# Altium schematic sheet connectors1.0.SchDoc
size 431 x 279 mm; SheetNumber: 1; SheetTotal: 1
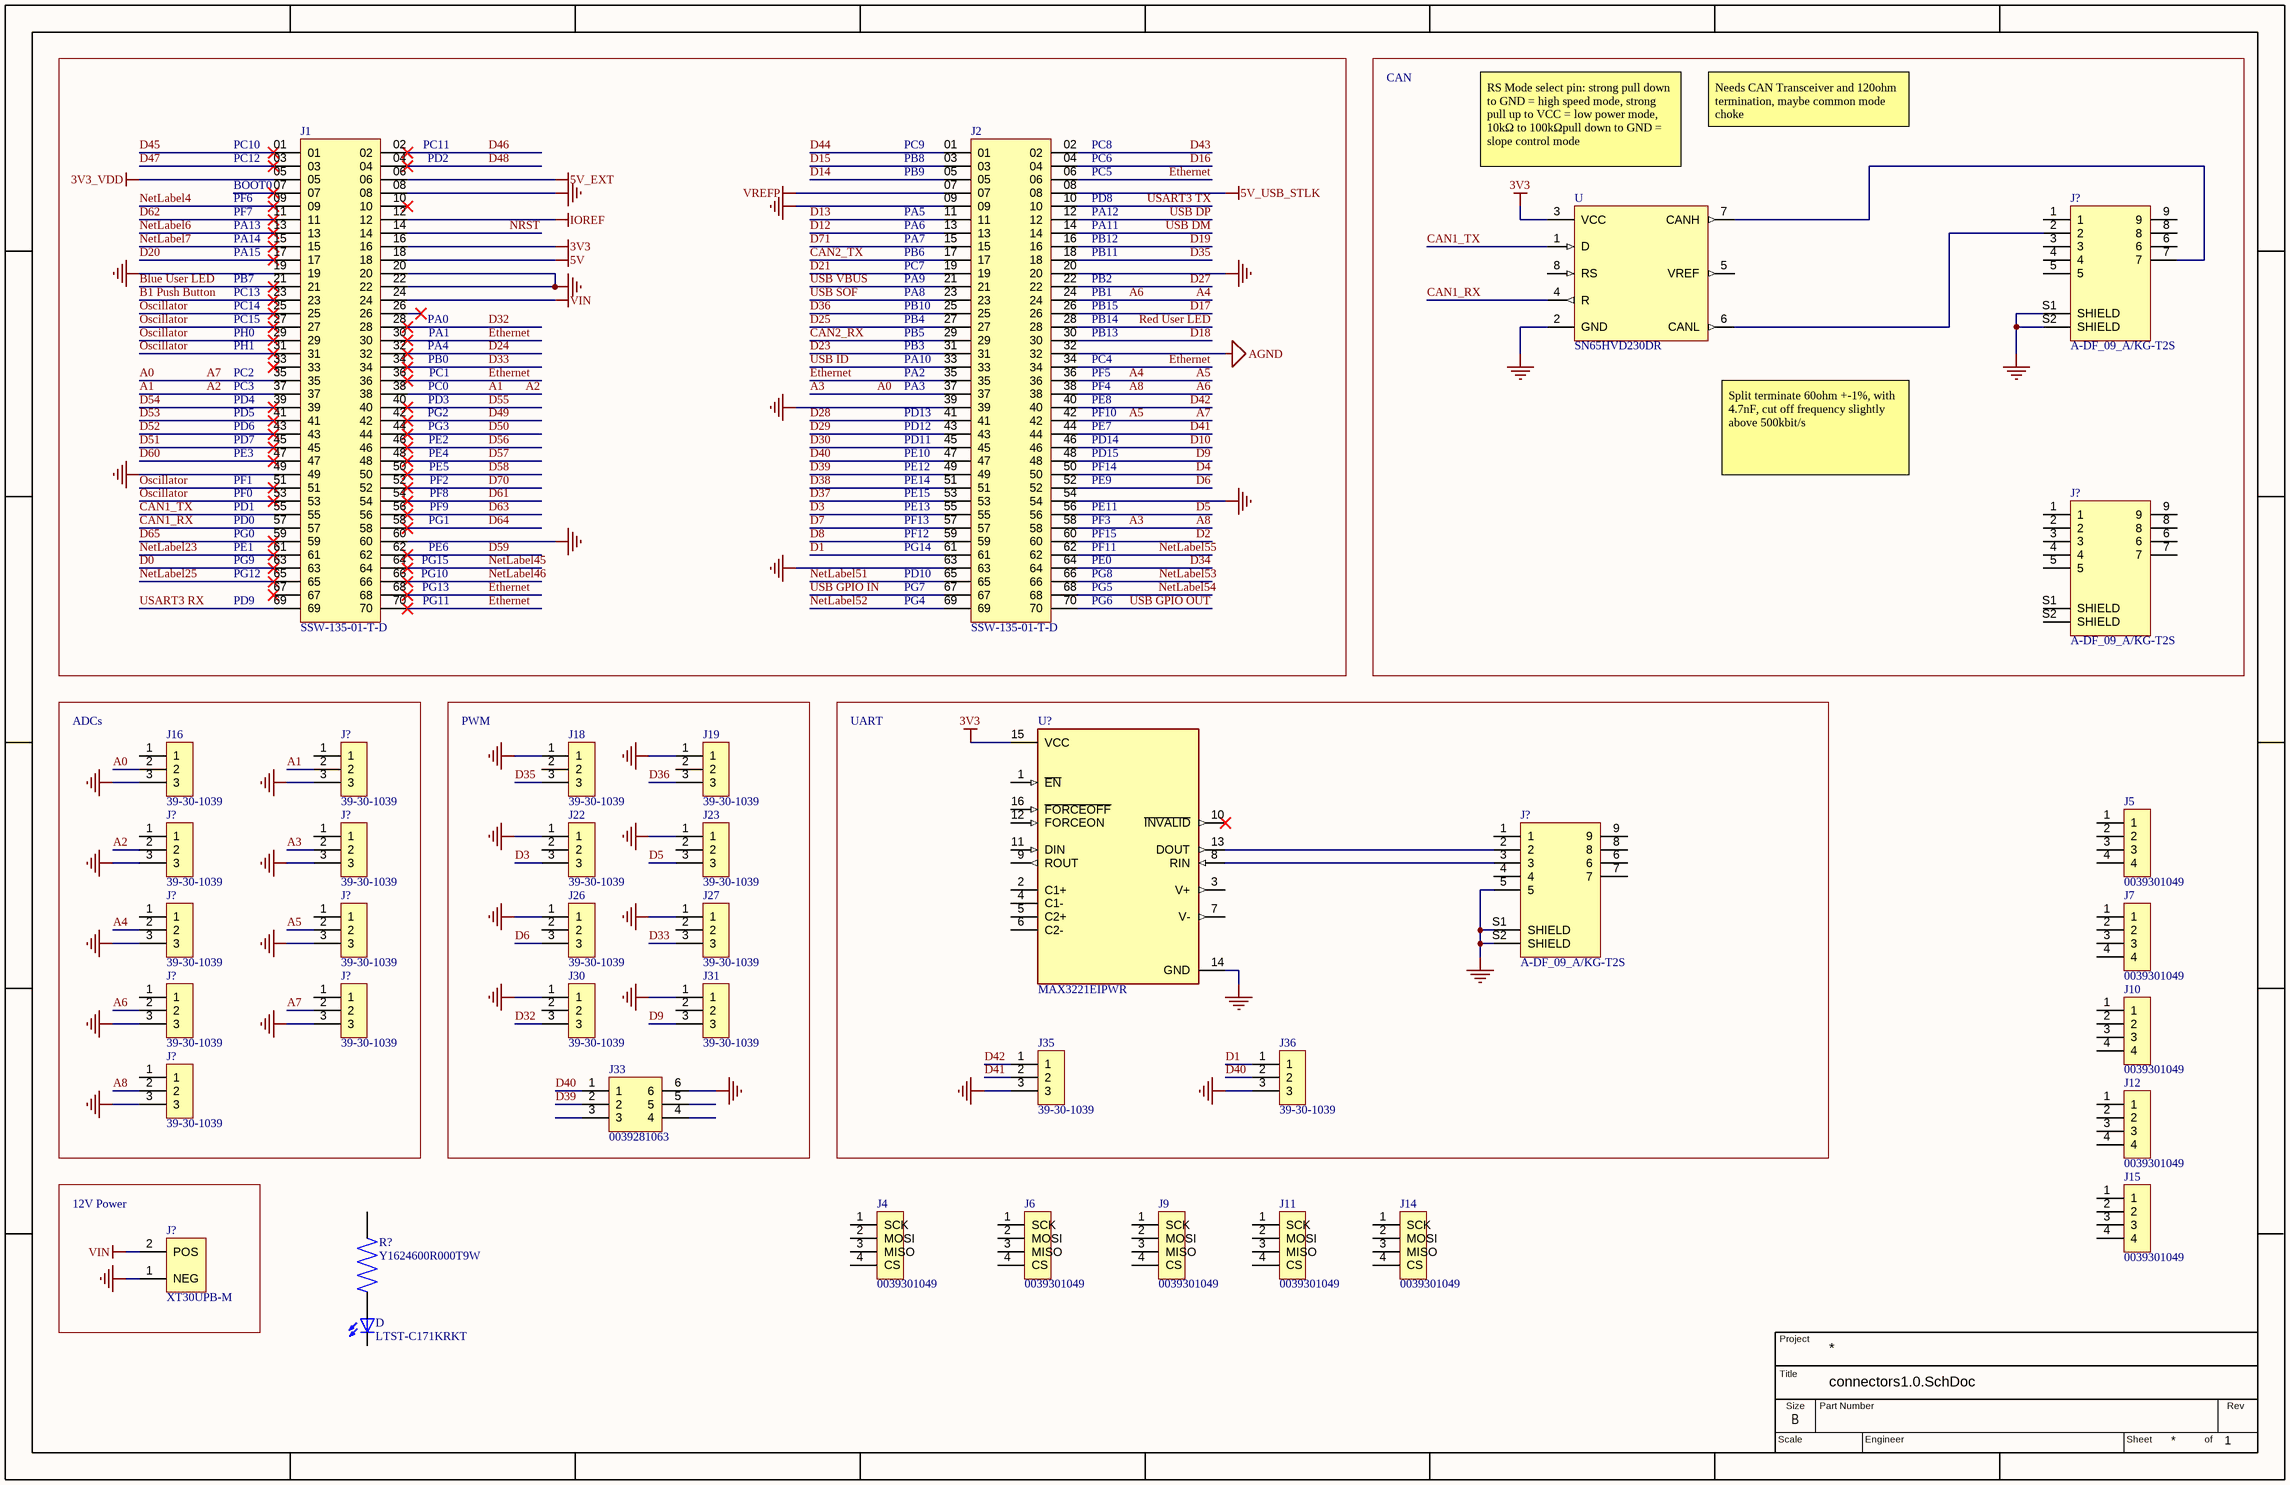
[diagram p0: connectors1.0.SchDoc]

## Parts
(Parts that share a designator on the sheet are numbered #1, #2 ... from top to bottom, then left to right.)
D  LTST-C171KRKT  [DIOC200X125X110]
J1  SSW-135-01-T-D  [SAMTEC_SSW-135-01-T-D]
J2  SSW-135-01-T-D  [SAMTEC_SSW-135-01-T-D]
J4  0039301049  [MOLEX_0039301049]
J5  0039301049  [MOLEX_0039301049]
J6  0039301049  [MOLEX_0039301049]
J7  0039301049  [MOLEX_0039301049]
J9  0039301049  [MOLEX_0039301049]
J10  0039301049  [MOLEX_0039301049]
J11  0039301049  [MOLEX_0039301049]
J12  0039301049  [MOLEX_0039301049]
J14  0039301049  [MOLEX_0039301049]
J15  0039301049  [MOLEX_0039301049]
J16  39-30-1039  [MOLEX_39-30-1039]
J18  39-30-1039  [MOLEX_39-30-1039]
J19  39-30-1039  [MOLEX_39-30-1039]
J22  39-30-1039  [MOLEX_39-30-1039]
J23  39-30-1039  [MOLEX_39-30-1039]
J26  39-30-1039  [MOLEX_39-30-1039]
J27  39-30-1039  [MOLEX_39-30-1039]
J30  39-30-1039  [MOLEX_39-30-1039]
J31  39-30-1039  [MOLEX_39-30-1039]
J33  0039281063  [MOLEX_0039281063]
J35  39-30-1039  [MOLEX_39-30-1039]
J36  39-30-1039  [MOLEX_39-30-1039]
J?#1  A-DF_09_A/KG-T2S  [ASSMANN_A-DF09A/KG-T2S]
J?#2  A-DF_09_A/KG-T2S  [ASSMANN_A-DF09A/KG-T2S]
J?#3  39-30-1039  [MOLEX_39-30-1039]
J?#4  39-30-1039  [MOLEX_39-30-1039]
J?#5  39-30-1039  [MOLEX_39-30-1039]
J?#6  A-DF_09_A/KG-T2S  [ASSMANN_A-DF09A/KG-T2S]
J?#7  39-30-1039  [MOLEX_39-30-1039]
J?#8  39-30-1039  [MOLEX_39-30-1039]
J?#9  39-30-1039  [MOLEX_39-30-1039]
J?#10  39-30-1039  [MOLEX_39-30-1039]
J?#11  39-30-1039  [MOLEX_39-30-1039]
J?#12  XT30UPB-M  [AMASS_XT30-M]
R?  Y1624600R000T9W  [RESC2012X64N]
U  SN65HVD230DR  [SOIC127P599X175-8N]
U?  MAX3221EIPWR  [SOP65P640X120-16N]

## Blocks framed on the sheet
CAN: J?#1 J?#2 U
ADCs: J16 J?#3-J?#5 J?#7-J?#11
PWM: J18 J19 J22 J23 J26 J27 J30 J31 J33
UART: J35 J36 J?#6 U?
12V Power: J?#12

## Nets
3V3: J1.16 U.3(VCC) U?.15(VCC)
3V3_VDD: J1.05
5V: J1.18
5V_EXT: J1.06
5V_USB_STLK: J2.08
AGND: J2.32
GND: J1.08 J1.19 J1.20 J1.22 J1.49 J1.60 J2.09 J2.20 J2.39 J2.54 J2.63 J16.3 J18.1 J19.1 J22.1 J23.1 J26.1 J27.1 J30.1 J31.1 J33.6 J35.3 J36.3 J?#1.S1(SHIELD) J?#1.S2(SHIELD) J?#3.3 J?#4.3 J?#5.3 J?#6.5 J?#6.S1(SHIELD) J?#6.S2(SHIELD) J?#7.3 J?#8.3 J?#9.3 J?#10.3 J?#11.3 J?#12.1(NEG) U.2(GND) U?.14(GND)
IOREF: J1.12
VIN: J1.24 J?#12.2(POS)
VREFP: J2.07
A0: J1.35 J2.24 J2.36 J2.37 J2.38 J2.42 J2.58 J16.2 J?#5.2 J?#7.2 J?#8.2 J?#9.2 J?#10.2 J?#11.2  [also labelled A3, A4, A5, A6, A7, A8]
A1: J1.37 J1.38 J?#3.2 J?#4.2  [also labelled A2]
B1 Push Button: J1.23
Blue User LED: J1.21
CAN1_RX: J1.57 U.4(R)
CAN1_TX: J1.55 U.1(D)
CAN2_RX: J2.29
CAN2_TX: J2.17
D0: J1.63
D1: J2.61 J36.1
D2: J2.60
D3: J2.55 J22.3
D4: J2.50
D5: J2.56 J23.3
D6: J2.52 J26.3
D7: J2.57
D8: J2.59
D9: J2.48 J31.3
D10: J2.46
D12: J2.13
D13: J2.11
D14: J2.05
D15: J2.03
D16: J2.04
D17: J2.26
D18: J2.30
D19: J2.16
D20: J1.17
D21: J2.19
D23: J2.31
D24: J1.32
D25: J2.27
D27: J2.22
D28: J2.41
D29: J2.43
D30: J2.45
D32: J1.28 J30.3
D33: J1.34 J27.3
D34: J2.64
D35: J2.18 J18.3
D36: J2.25 J19.3
D37: J2.53
D38: J2.51
D39: J2.49 J33.2
D40: J2.47 J33.1 J36.2
D41: J2.44 J35.2
D42: J2.40 J35.1
D43: J2.02
D44: J2.01
D45: J1.01
D46: J1.02
D47: J1.03
D48: J1.04
D49: J1.42
D50: J1.44
D51: J1.45
D52: J1.43
D53: J1.41
D54: J1.39
D55: J1.40
D56: J1.46
D57: J1.48
D58: J1.50
D59: J1.62
D60: J1.47
D61: J1.54
D62: J1.11
D63: J1.56
D64: J1.58
D65: J1.59
D70: J1.52
D71: J2.15
Ethernet: J1.30 J1.36 J1.68 J1.70 J2.06 J2.34 J2.35
NetLabel4: J1.09
NetLabel6: J1.13
NetLabel7: J1.15
NetLabel23: J1.61
NetLabel25: J1.65
NetLabel45: J1.64
NetLabel46: J1.66
NetLabel51: J2.65
NetLabel52: J2.69
NetLabel53: J2.66
NetLabel54: J2.68
NetLabel55: J2.62
NRST: J1.14
Oscillator: J1.25 J1.27 J1.29 J1.31 J1.51 J1.53
Red User LED: J2.28
USART3 RX: J1.69
USART3 TX: J2.10
USB DM: J2.14
USB DP: J2.12
USB GPIO IN: J2.67
USB GPIO OUT: J2.70
USB ID: J2.33
USB SOF: J2.23
USB VBUS: J2.21
NetJ?#1_2: J?#1.2 U.6(CANL)
NetJ?#1_7: J?#1.7 U.7(CANH)
NetJ?#6_2: J?#6.2 U?.13(DOUT)
NetJ?#6_3: J?#6.3 U?.8(RIN)

Not connected (* = marked no-connect by the designer): D NEG POS; J1 07* 10* 26* 33* 67*; J4 1(SCK) 2(MOSI) 3(MISO) 4(CS); J5 1 2 3 4; J6 1(SCK) 2(MOSI) 3(MISO) 4(CS); J7 1 2 3 4; J9 1(SCK) 2(MOSI) 3(MISO) 4(CS); J10 1 2 3 4; J11 1(SCK) 2(MOSI) 3(MISO) 4(CS); J12 1 2 3 4; J14 1(SCK) 2(MOSI) 3(MISO) 4(CS); J15 1 2 3 4; J16 1; J18 2; J19 2; J22 2; J23 2; J26 2; J27 2; J30 2; J31 2; J33 3 4 5; J?#1 1 3 4 5 6 8 9; J?#2 1 2 3 4 5 6 7 8 9 S1(SHIELD) S2(SHIELD); J?#3 1; J?#4 1; J?#5 1; J?#6 1 4 6 7 8 9; J?#7 1; J?#8 1; J?#9 1; J?#10 1; J?#11 1; R? 1 2; U 5(VREF) 8(RS); U? 1(~{EN}) 2(C1+) 3(V+) 4(C1-) 5(C2+) 6(C2-) 7(V-) 9(ROUT) 10(~{INVALID})* 11(DIN) 12(FORCEON) 16(~{FORCEOFF})

## Notes on the sheet
- (near J1) PC10
- (near J1) PC12
- (near J1) PC11
- (near J1) PD2
- (near J2) PC9
- (near J2) PB8
- (near J2) PC6
- (near J2) PC8
- RS Mode select pin: strong pull down to GND = high speed mode, strong
  pull up to VCC = low power mode, 10kΩ to 100kΩpull down to GND = slope control mode
- Needs CAN Transceiver and 120ohm termination, maybe common mode choke
- (near J1) PF6
- (near J1) PF7
- (near J1) PA13
- (near J1) BOOT0
- (near J2) PB9
- (near J2) PA5
- (near J2) PA6
- (near J2) PA11
- (near J2) PA12
- (near J2) PD8
- (near J2) PC5
- (near J1) PA14
- (near J1) PA15
- (near J1) PB7
- (near J1) PC13
- (near J2) PA7
- (near J2) PC7
- (near J2) PA9
- (near J2) PA8
- (near J2) PB6
- (near J2) PB1
- (near J2) PB2
- (near J2) PB11
- (near J2) PB12
- (near J1) PC14
- (near J1) PC15
- (near J1) PH0
- (near J1) PH1
- (near J1) PA4
- (near J1) PA0
- (near J1) PB0
- (near J1) PA1
- (near J2) PB10
- (near J2) PB4
- (near J2) PB3
- (near J2) PA10
- (near J2) PB5
- (near J2) PC4
- (near J2) PB13
- (near J2) PB14
- (near J2) PB15
- (near J1) PC3
- (near J1) PC2
- (near J1) PD4
- (near J1) PD5
- (near J1) PD6
- (near J1) PG2
- (near J1) PD3
- (near J1) PG3
- (near J1) PC0
- (near J1) PC1
- (near J2) PA2
- (near J2) PD13
- (near J2) PD12
- (near J2) PA3
- (near J2) PF5
- (near J2) PF10
- (near J2) PF4
- (near J2) PE7
- (near J2) PE8
- (near J1) PD7
- (near J1) PE3
- (near J1) PF1
- (near J1) PF0
- (near J1) PE4
- (near J1) PE2
- (near J1) PE5
- (near J1) PF2
- (near J1) PF8
- (near J2) PD11
- (near J2) PE10
- (near J2) PE12
- (near J2) PE14
- (near J2) PE15
- (near J2) PE9
- (near J2) PF14
- (near J2) PD15
- (near J2) PD14
- Split terminate 60ohm +-1%, with 4.7nF, cut off frequency slightly above 500kbit/s
- (near J1) PD0
- (near J1) PD1
- (near J1) PG0
- (near J1) PE1
- (near J1) PG9
- (near J1) PG15
- (near J1) PG1
- (near J1) PE6
- (near J1) PF9
- (near J2) PE13
- (near J2) PF13
- (near J2) PF12
- (near J2) PG14
- (near J2) PF3
- (near J2) PE0
- (near J2) PF11
- (near J2) PF15
- (near J2) PE11
- (near J1) PG12
- (near J1) PD9
- (near J1) PG10
- (near J1) PG13
- (near J1) PG11
- (near J2) PD10
- (near J2) PG7
- (near J2) PG4
- (near J2) PG6
- (near J2) PG5
- (near J2) PG8
- Title
- Project
- Scale
- Size
- B
- Part Number
- Engineer
- Sheet
- of
- Rev

## Library data of the parts
D = LTST-C171KRKT: Red 631nm LED Indication - Discrete 2V 0805 _2012 Metric_; MF: Lite-On Inc.; MP: LTST-C171KRKT; Package: 0805 Lite-On; Price: None; Availability: Unavailable; SnapEDA_Link: https://www.snapeda.com/parts/LTST-C171KRKT/Lite-On%20Inc./view-part/357775/?ref=snap; Value: *
J1 J2 = SSW-135-01-T-D: MF: Samtec; Value: *; Price: None; Package: None; Availability: Unavailable; MP: SSW-135-01-T-D
J4-J7 J9-J12 J14 J15 = 0039301049: Connector Header Through Hole 4 position 0.165 _4.20mm_; MF: Molex; Value: *; Package: None; Price: None; SnapEDA_Link: https://www.snapeda.com/parts/0039301049/Molex/view-part/104320/?ref=snap; Availability: Unavailable; MP: 0039301049
J16 J18 J19 J22 J23 J26 J27 J30 J31 J35 J36 J?#3-J?#5 J?#7-J?#11 = 39-30-1039: Connector Header Through Hole 3 position 0.165 _4.20mm_; MP: 39301039; MF: Molex; Price: None; Value: *; Package: None; SnapEDA_Link: https://www.snapeda.com/parts/39301039/Molex/view-part/1160208/?ref=snap; Availability: Unavailable
J33 = 0039281063: Connector Header Through Hole, 6 position 0.165 (4.20mm); MP: 0026013115; MF: Molex; Package: None; DigiKey-Purchase-URL: https://snapeda.com/shop?store=DigiKey&id=2597941; Value: *; SnapEDA_Link: https://www.snapeda.com/parts/0026013115/Molex/view-part/2597941/?ref=snap; Price: None; Availability: Unavailable
J?#1 J?#2 J?#6 = A-DF_09_A/KG-T2S: 9 Position D-Sub Receptacle, Female Sockets Connector; MP: A-DF 09 A/KG-T2S; MF: Assmann WSW; SnapEDA_Link: https://www.snapeda.com/parts/A-DF%2009%20A/KG-T2S/Assmann%20WSW%20Components/view-part/2761262/?ref=snap; Availability: Unavailable; Check_prices: https://www.snapeda.com/parts/A-DF%2009%20A/KG-T2S/Assmann%20WSW%20Components/view-part/2761262/?ref=eda; Price: None; Value: *; Package: None
J?#12 = XT30UPB-M: Plug; DC supply; XT60; male; PIN: 2; for cable; soldered; 30A; 500V; MP: XT60-M; MF: AMASS; Price: None; Package: Package Analog Devices; Value: *; Availability: Unavailable; SnapEDA_Link: https://www.snapeda.com/parts/XT60-M/AMASS/view-part/2883912/?ref=snap
U = SN65HVD230DR: 3.3 V CAN Transceiver with Standby Mode 8-SOIC -40 to 85; MF: Texas Instruments; Package: SOIC-8 Texas Instruments; DigiKey-Purchase-URL: https://snapeda.com/shop?store=DigiKey&id=51767; MP: SN65HVD230DR; Mouser-Purchase-URL: https://snapeda.com/shop?store=Mouser&id=51767; Value: *; Arrow_Electronics-Purchase-URL: https://snapeda.com/shop?store=Arrow+Electronics&id=51767; Availability: Good; SnapEDA_Link: https://www.snapeda.com/parts/SN65HVD230DR/Texas%20Instruments/view-part/51767/?ref=snap; Price: None; Texas_Instruments-Purchase-URL: https://snapeda.com/shop?store=Texas+Instruments&id=51767
U? = MAX3221EIPWR: 3-V to 5.5-V Single-Channel RS-232 Line Driver/Receiver 16-TSSOP 0 to 70; Value: *; Availability: Unavailable; Package: None; MP: MAX3221EIPWR; Price: None
R? = Y1624600R000T9W: Package: None; Price: None; Value: *; MP: Y1624600R000T9W; Availability: Unavailable